# EAGLE design Control (EAGLE 7.6.0)
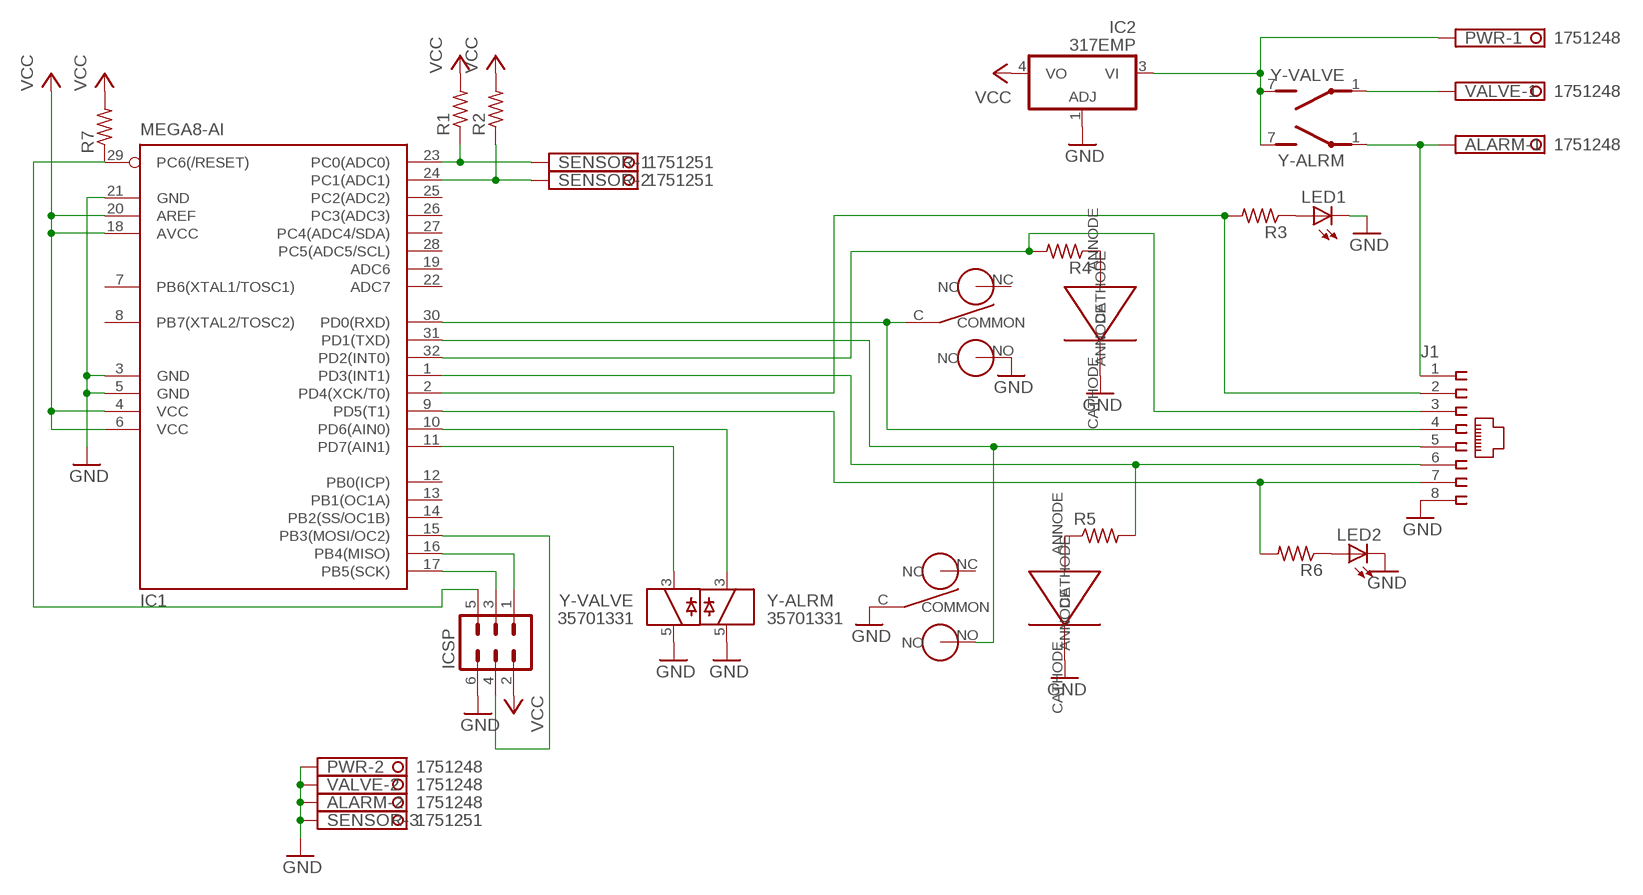
[diagram p0: schematic, sheet 1]

## Parts
ALARM  1751248  [1751248]
BUTTON1  LED-BUTTON-16MM  [16MM]
BUTTON2  LED-BUTTON-16MM  [16MM]
IC1  MEGA8-AI  [TQFP32-08]
IC2  317EMP  [SOT223]
ICSP  MA03-2  [MA03-2]
J1  215877-7  [215877-7]
LED1  LED5MM  [LED5MM]
LED2  LED5MM  [LED5MM]
PWR  1751248  [1751248]
R1  R-US_M0805  [M0805]
R2  R-US_M0805  [M0805]
R3  R-US_M0805  [M0805]
R4  R-US_M0805  [M0805]
R5  R-US_M0805  [M0805]
R6  R-US_M0805  [M0805]
R7  R-US_M0805  [M0805]
SENSOR  1751251  [1751251]
VALVE  1751248  [1751248]
Y-ALRM  35701331  [REED]
Y-VALVE  35701331  [REED]

## Nets
GND: ALARM.2 BUTTON1.CATHODE BUTTON1.NO BUTTON2.C(COMMON) BUTTON2.CATHODE IC1.3(GND) IC1.5(GND) IC1.21(GND) IC2.1(ADJ) ICSP.6 J1.8 LED1.K(C) LED2.K(C) PWR.2 SENSOR.3 VALVE.2 Y-ALRM.5 Y-VALVE.5
N$1: ALARM.1 J1.1 Y-ALRM.1(2:P)
N$2: VALVE.1 Y-VALVE.1(2:P)
N$3: IC1.23(PC0(ADC0)) R1.1 SENSOR.1
N$4: IC1.24(PC1(ADC1)) R2.1 SENSOR.2
N$5: IC1.32(PD2(INT0)) J1.3 R4.2
N$6: IC1.1(PD3(INT1)) J1.6 R5.2
N$7: LED1.A R3.1
N$8: BUTTON2.ANNODE R5.1
N$9: LED2.A R6.1
N$10: BUTTON1.ANNODE R4.1
N$11: BUTTON1.C(COMMON) IC1.30(PD0(RXD)) J1.4
N$12: BUTTON2.NO IC1.31(PD1(TXD)) J1.5
N$13: IC1.2(PD4(XCK/T0)) J1.2 R3.2
N$14: IC1.9(PD5(T1)) J1.7 R6.2
N$15: IC1.11(PD7(AIN1)) Y-VALVE.3
N$16: IC1.10(PD6(AIN0)) Y-ALRM.3
N$18: IC1.29(PC6(/RESET)) ICSP.5 R7.1
N$19: IC1.16(PB4(MISO)) ICSP.1
N$20: IC1.17(PB5(SCK)) ICSP.3
N$21: IC1.15(PB3(MOSI/OC2)) ICSP.4
VCC: IC1.4(VCC) IC1.6(VCC) IC1.18(AVCC) IC1.20(AREF) IC2.4(VO) ICSP.2 R1.2 R2.2 R7.2
VIN: IC2.3(VI) PWR.1 Y-ALRM.7(2:S) Y-VALVE.7(2:S)
Unconnected: BUTTON1.NC BUTTON2.NC IC1.7(PB6(XTAL1/TOSC1)) IC1.8(PB7(XTAL2/TOSC2)) IC1.12(PB0(ICP)) IC1.13(PB1(OC1A)) IC1.14(PB2(SS/OC1B)) IC1.19(ADC6) IC1.22(ADC7) IC1.25(PC2(ADC2)) IC1.26(PC3(ADC3)) IC1.27(PC4(ADC4/SDA)) IC1.28(PC5(ADC5/SCL))

## Library data of the parts
ALARM PWR VALVE = con-phoenix-350:1751248: MKDS 1/ 2-3,5 Printklemme Nennstrom: 10 A Bemessungsspannung: 160 V Raster: 3,5 mm Polzahl: 2 Montageart: Löten Anschlussart: Schraubanschluss Anschlussrichtung vom Leiter zur Platine: 0° Source: http://eshop.phoenixcontact.com .. 1751248.pdf; OC_FARNELL: unknown; OC_NEWARK: unknown
BUTTON1 BUTTON2 = AliExpress:LED-BUTTON-16MM
IC1 = atmel:MEGA8: MICROCONTROLLER 8 Kbytes FLASH, 1 kbytes SRAM, 512 bytes EEPROM, USART, 6-channel 10 bit ADC, 2-channel 8 bit ADC Pin compatible with Atmega48, ATMega88, ATMega168 Source: avr.lbr; MPN: ATMEGA8-16AU; OC_FARNELL: 9171371; OC_NEWARK: 73M8863
IC2 = linear:*317: Positive VOLTAGE REGULATOR
ICSP = con-lstb:MA03-2: PIN HEADER; OC_FARNELL: unknown; OC_NEWARK: unknown
J1 = con-amp:215877-7: AMP connector
LED1 LED2 = led:LED: LED OSRAM: - CHIPLED LG R971, LG N971, LY N971, LG Q971, LY Q971, LO R971, LY R971 LH N974, LH R974 LS Q976, LO Q976, LY Q976 LO Q996 - Hyper CHIPLED LW Q18S LB Q993, LB Q99A, LB R99A - SideLED LS A670, LO A670, LY A670, LG A670, LP A670 LB A673, LV A673, LT A673, LW A673 LH A674 LY A675 LS A676, LA A676, LO A676, LY A676, LW A676 LS A679, LY A679, LG A679 - Hyper Micro SIDELED® LS Y876, LA Y876, LO Y876, LY Y876 LT Y87S - SmartLED LW L88C, LW L88S LB L89C, LB L89S, LG L890 LS L89K, LO L89K, LY L89K LS L896, LA L896, LO L896, LY L896 - TOPLED LS T670, LO T670, LY T670, LG T670, LP T670 LSG T670, LSP T670, LSY T670, LOP T670, LYG T670 LG T671, LOG T671, LSG T671 LB T673, LV T673, LT T673, LW T673 LH T674 LS T676, LA T676, LO T676, LY T676, LB T676, LH T676, LSB T676, LW T676 LB T67C, LV T67C, LT T67C, LS T67K, LO T67K, LY T67K, LW E67C LS E67B, LA E67B, LO E67B, LY E67B, LB E67C, LV E67C, LT E67C LW T67C LS T679, LY T679, LG T679 LS T770, LO T770, LY T770, LG T770, LP T770 LB T773, LV T773, LT T773, LW T773 LH T774 LS E675, LA E675, LY E675, LS T675 LS T776, LA T776, LO T776, LY T776, LB T776 LHGB T686 LT T68C, LB T68C - Hyper Mini TOPLED® LB M676 - Mini TOPLED Santana® LG M470 LS M47K, LO M47K, LY M47K Source: http://www.osram.convergy.de LUXEON: - LUMILED® LXK2-PW12-R00, LXK2-PW12-S00, LXK2-PW14-U00, LXK2-PW14-V00 LXK2-PM12-R00, LXK2-PM12-S00, LXK2-PM14-U00 LXK2-PE12-Q00, LXK2-PE12-R00, LXK2-PE12-S00, LXK2-PE14-T00, LXK2-PE14-U00 LXK2-PB12-K00, LXK2-PB12-L00, LXK2-PB12-M00, LXK2-PB14-N00, LXK2-PB14-P00, LXK2-PB14-Q00 LXK2-PR12-L00, LXK2-PR12-M00, LXK2-PR14-Q00, LXK2-PR14-R00 LXK2-PD12-Q00, LXK2-PD12-R00, LXK2-PD12-S00 LXK2-PH12-R00, LXK2-PH12-S00 LXK2-PL12-P00, LXK2-PL12-Q00, LXK2-PL12-R00 Source: www.luxeon.com KINGBRIGHT: KA-3528ASYC Source: www.kingbright.com
R1-R7 = resistor:R-US_: RESISTOR, American symbol
SENSOR = con-phoenix-350:1751251: MKDS 1/ 3-3,5 Printklemme Nennstrom: 10 A Bemessungsspannung: 160 V Raster: 3,5 mm Polzahl: 3 Montageart: Löten Anschlussart: Schraubanschluss Anschlussrichtung vom Leiter zur Platine: 0° Source: http://eshop.phoenixcontact.com .. 1751251.pdf; OC_FARNELL: unknown; OC_NEWARK: unknown
Y-ALRM Y-VALVE = relay:35701331: RELAY reed, 1 x norm. open with polarity; OC_FARNELL: unknown; OC_NEWARK: unknown

## Board
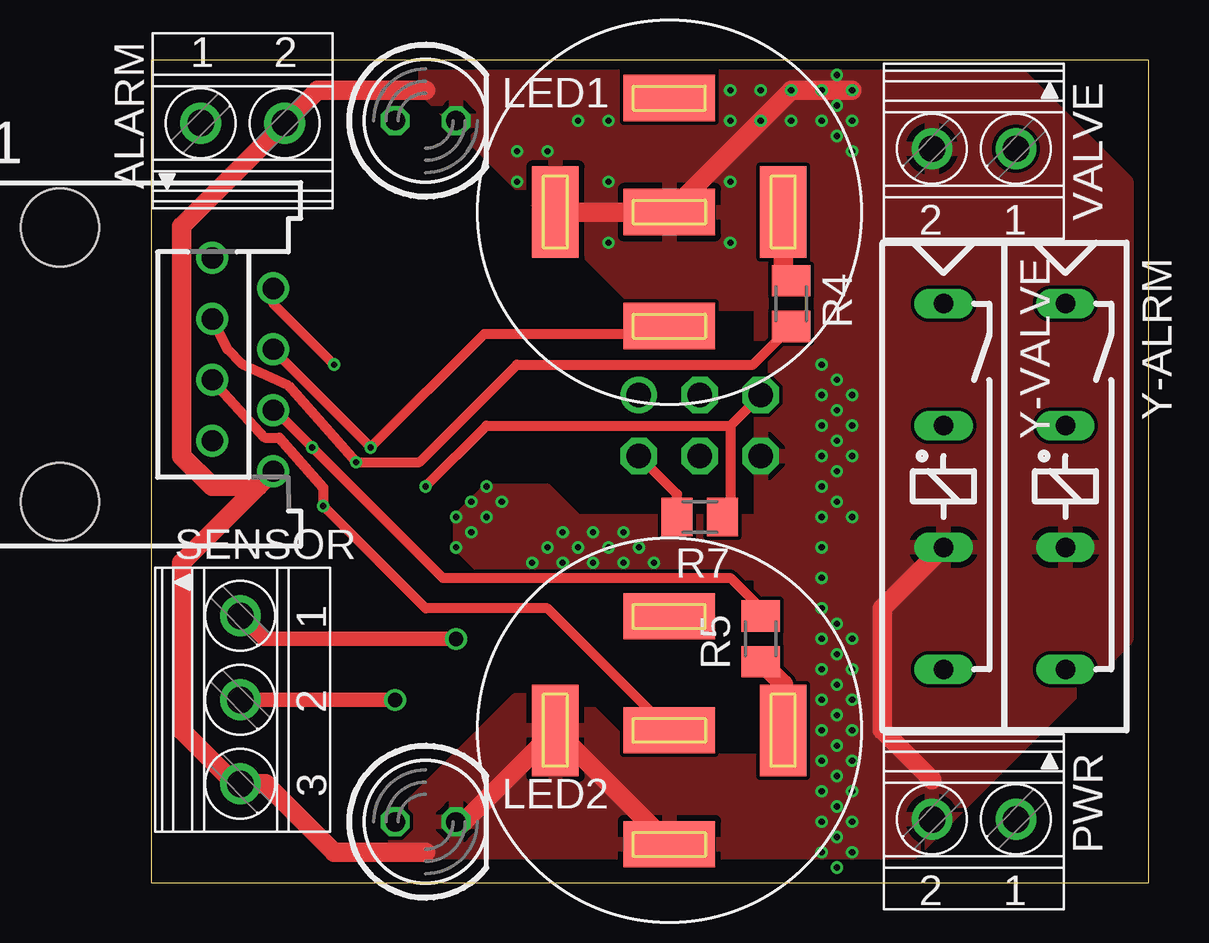
[diagram p1: board, top side]
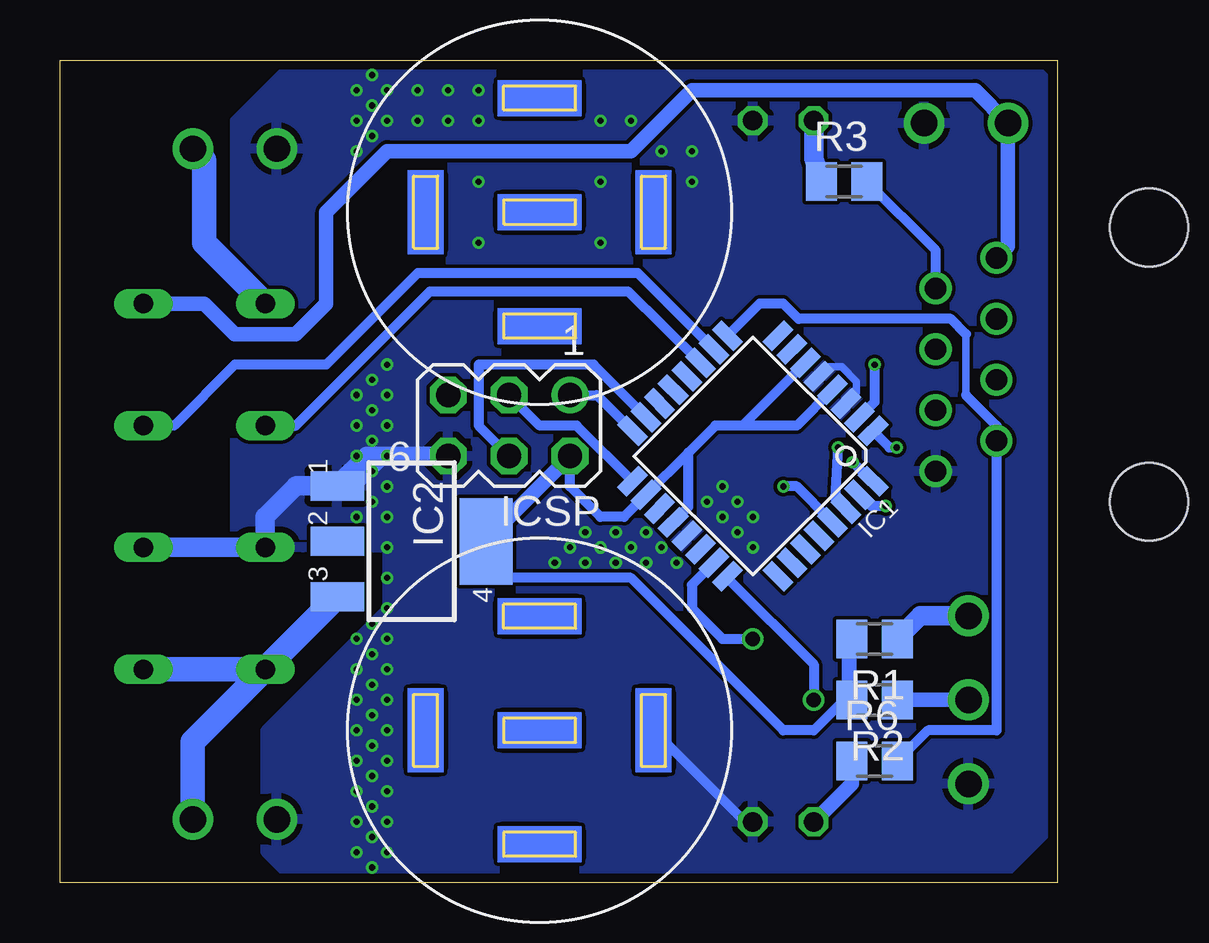
[diagram p2: board, bottom side, seen from below]

Size 41.58 x 34.28 mm. Coordinates in mm from the lower left corner, seen from the top.
Outline: 0,0 41.58,0 41.58,34.28 0,34.28 0,0
Copper layers (1*16): Top 0.035559375mm / dielectric 1.6mm / Bottom 0.035559375mm
Design rules "oshpark-2layer": minimum track width 6mil, minimum drill 10mil, track to track 6mil, track to pad 6mil, pad to pad 6mil, via to via 6mil, smd to smd 6mil, copper to edge 15mil, drill to drill 6mil, minimum pad ring 5mil, minimum via ring 5mil, stop-mask expansion 2.5mil, vias tented up to drill 0mil, thermal gap 10mil

### Footprints (pad centres in the part's own frame; a part is rotated, then mirrored left to right if it is on the bottom)
1751248 = drill 1.1 pad 1.7: 1 -1.75,-0.1; 2 1.75,-0.1
16MM = smd 1.93 x 3.81: ANNODE 4.75,0; CATHODE -4.75,0 | smd 3.81 x 1.93: C 0,-4.75; NC 0,4.75; NO 0,0
TQFP32-08 = smd 1.27 x 0.559: 1 -4.293,2.8; 2 -4.293,2; 3 -4.293,1.2; 4 -4.293,0.4; 5 -4.293,-0.4; 6 -4.293,-1.2; 7 -4.293,-2; 8 -4.293,-2.8; 17 4.293,-2.8; 18 4.293,-2; 19 4.293,-1.2; 20 4.293,-0.4; 21 4.293,0.4; 22 4.293,1.2; 23 4.293,2; 24 4.293,2.8 | smd 0.559 x 1.27: 9 -2.8,-4.293; 10 -2,-4.293; 11 -1.2,-4.293; 12 -0.4,-4.293; 13 0.4,-4.293; 14 1.2,-4.293; 15 2,-4.293; 16 2.8,-4.293; 25 2.8,4.293; 26 2,4.293; 27 1.2,4.293; 28 0.4,4.293; 29 -0.4,4.293; 30 -1.2,4.293; 31 -2,4.293; 32 -2.8,4.293
SOT223 = smd 1.219 x 2.235: 1 -2.311,-3.099; 2 0,-3.099; 3 2.311,-3.099 | smd 3.6 x 2.2: 4 0,3.099
MA03-2 = drill 1.016: 1 -2.54,-1.27 | drill 1.016 octagon: 2 -2.54,1.27; 3 0,-1.27; 4 0,1.27; 5 2.54,-1.27; 6 2.54,1.27
215877-7 = drill 0.889: 1 -4.445,6.35; 2 -3.175,8.89; 3 -1.905,6.35; 4 -0.635,8.89; 5 0.635,6.35; 6 1.905,8.89; 7 3.175,6.35; 8 4.445,8.89 | hole 3.251: -5.715,0; 5.715,0
LED5MM = drill 0.813 octagon: A -1.27,0; K 1.27,0
M0805 = smd 1.3 x 1.6: 1 -0.95,0; 2 0.95,0
1751251 = drill 1.1 pad 1.7: 1 -3.5,-0.1; 2 0,-0.1; 3 3.5,-0.1
REED = drill 0.813 long: 1 -17.78,2.54; 3 -12.7,2.54; 5 -7.62,2.54; 7 -2.54,2.54

### Placement (x,y rotation side)
ALARM  3.81,31.75 0 top
BUTTON1  21.59,27.94 0 top
BUTTON2  21.59,6.35 0 top
IC1  12.7,17.78 225 bottom
IC2  26.92,14.22 270 bottom
ICSP  22.86,19.05 180 bottom
J1  -3.81,21.59 270 top
LED1  11.43,31.75 0 top
LED2  11.43,2.54 0 top
PWR  34.29,2.54 180 top
R1  7.62,10.16 180 bottom
R2  7.62,7.62 180 bottom
R3  8.89,29.21 0 bottom
R4  26.67,24.13 270 top
R5  25.4,10.16 90 top
R6  7.62,5.08 0 bottom
R7  22.86,15.24 180 top
SENSOR  3.81,7.62 270 top
VALVE  34.29,30.48 180 top
Y-ALRM  35.56,6.35 270 top
Y-VALVE  30.48,6.35 270 top

### Tracks (layer width: path | path; a pad name or v marks a point on that pad's centre or on a via)
GND  (via drill 0.25)
  Top 0.813: BUTTON2.C BUTTON2.CATHODE 13.03,2.54 | 11.43,1.27 7.62,1.27 4.77,4.12 SENSOR.3 3.5,4.12 1.27,6.35 1.27,13.34 J1.8 4.45,16.51 2.54,16.51 1.27,17.78 1.27,27.36 ALARM.2 6.93,33.02 11.43,33.02 | v29.21,33.02 v26.67,33.02 BUTTON1.NO BUTTON1.CATHODE 16.51,27.94 | Y-VALVE.5 30.48,11.43 30.48,6.35 32.54,4.29
  Bottom 0.152: 9.6,21.49 9.91,21.18 IC1.5 | 8.69,20.12 IC1.3
  Bottom 0.305: 9.6,21.49 8.99,21.49 8.38,20.88 8.38,20.42 8.69,20.12
  Bottom 0.406: BUTTON2.CATHODE 13.03,2.54 | v27.94,17.78 29.21,16.51 31.75,16.51
  Bottom 0.813: Y-ALRM.5 Y-VALVE.5 33.02,15.24 31.75,16.51 31.73,16.54 IC2.1 28.78,17.78 v27.94,17.78 ICSP.6
  other vias: 13.97,15.24 12.7,13.97 12.7,15.24 13.97,16.51 16.51,13.97 17.14,14.61 17.78,13.97 19.05,29.21 19.05,26.67 24.13,26.67 24.13,29.21 24.13,31.75 25.4,31.75 25.4,33.02 24.13,33.02 19.05,31.75 17.78,31.75 25.4,33.02 26.67,31.75 27.94,31.75 27.94,33.02 29.21,31.75 29.21,30.48 29.21,20.32 27.94,21.59 27.94,20.32 27.94,19.05 29.21,19.05 29.21,17.78 27.94,19.05 17.78,13.97 19.05,13.97 20.32,13.97 18.41,14.61 19.68,14.61 14.61,15.88 13.34,15.88 13.34,14.61 17.14,13.34 18.41,13.34 19.68,13.34 20.95,13.34 29.21,10.16 29.21,8.89 29.21,7.62 29.21,6.35 29.21,5.08 29.21,3.81 29.21,2.54 29.21,1.27 27.94,1.27 27.94,2.54 27.94,3.81 27.94,5.08 27.94,6.35 27.94,7.62 27.94,8.89 27.94,10.16 28.57,18.41 28.57,19.68 28.57,20.95 28.57,9.53 28.57,9.53 28.57,10.79 28.57,31.11 28.57,32.38 28.57,33.66 28.57,8.26 28.57,6.99 28.57,5.71 28.57,4.45 28.57,3.17 28.57,1.91 28.57,0.64 15.88,13.34 27.94,16.51 27.94,15.24 27.94,13.97 27.94,12.7 27.94,11.43 28.57,17.14 28.57,15.88 29.21,15.24 16.51,30.48 15.24,30.48 15.24,29.21
  pour Bottom: 0,2.54 0,33.02 1.27,34.29 31.75,34.29 34.29,31.75 34.29,13.97 27.94,13.97 27.94,11.43 33.02,6.35 33.02,1.27 31.75,0 2.54,0
  pour Top: 11.43,34.29 35.56,34.29 40.64,29.21 40.64,10.16 31.75,1.27 10.16,1.27 10.16,2.54 15.24,7.62 17.78,7.62 20.32,5.08 26.67,5.08 25.4,7.62 25.4,24.13 20.32,24.13 11.43,33.02
  pour Top: 13.97,12.7 12.7,13.97 12.7,15.24 13.97,16.51 16.51,16.51 17.78,15.24 25.4,15.24 25.4,12.7
N$1
  Bottom 0.61: Y-ALRM.1 35.56,24.13 34.29,22.86 31.75,22.86 30.48,24.13 30.48,27.94 27.94,30.48 17.78,30.48 15.24,33.02 3.43,33.02 ALARM.1 2.06,26.52 J1.1
N$2
  Bottom 1.016: Y-VALVE.1 35.56,26.67 35.56,30.1 VALVE.1
N$3  (via drill 0.6)
  Top 0.61: v12.7,10.16 4.67,10.16 SENSOR.1
  Bottom 0.406: IC1.23 15.24,12.41 15.24,11.43 13.97,10.16 v12.7,10.16
  Bottom 0.813: R1.1 5.71,11.12 SENSOR.1
N$4  (via drill 0.6)
  Top 0.61: SENSOR.2 v10.16,7.62
  Bottom 0.152: 13.72,12.65 IC1.24 | 6.86,7.47 R2.1
  Bottom 0.406: 13.72,12.65 10.16,9.09 v10.16,7.62
  Bottom 0.61: R2.1 SENSOR.2
N$5  (via drill 0.25)
  Top 0.254: 25.08,21.59 R4.2
  Top 0.406: J1.3 3.17,22.23 3.81,21.59 5.71,20.7 v8.53,17.53 11.18,17.53 15.24,21.59 25.08,21.59 R4.2
  Bottom 0.152: 7.77,16.76 IC1.32
  Bottom 0.406: 7.77,16.76 v8.53,17.53
N$6  (via drill 0.25)
  Top 0.152: 5.18,19.66 J1.6
  Top 0.254: 25.4,11.43 R5.2
  Top 0.305: 5.16,19.68 J1.6
  Top 0.406: 25.4,11.43 24.13,12.7 12.14,12.7 v6.71,18.14 5.16,19.68
  Bottom 0.152: 7.62,18.75 IC1.1 | 5.03,19.66 J1.6
  Bottom 0.406: 7.62,18.75 7.01,18.14 v6.71,18.14
N$7
  Bottom 0.813: R3.1 10.16,30.16 LED1.A
N$8
  Top 0.813: BUTTON2.ANNODE 26.34,8.27 R5.1
N$9
  Bottom 0.61: R6.1 8.57,4.13 LED2.A
N$10
  Top 0.813: R4.1 26.34,25.41 BUTTON1.ANNODE
N$11  (via drill 0.25)
  Top 0.254: BUTTON1.C 21.26,22.86 | 13.34,22.23 13.97,22.86 13.87,22.86
  Top 0.305: 5.08,22.2 J1.4
  Top 0.406: 21.26,22.86 13.97,22.86 | 13.87,22.86 v9.14,18.14 5.08,22.2
  Bottom 0.152: 8.84,15.7 IC1.30
  Bottom 0.305: 8.84,15.7 9.27,16
  Bottom 0.406: v9.14,18.14 9.27,16
N$12  (via drill 0.25)
  Top 0.152: 2.59,20.88 J1.5
  Top 0.406: 2.59,20.88 4.72,18.54 5.33,18.54 7.16,16.46 v7.16,15.7 11.43,11.43 16.51,11.43 BUTTON2.NO
  Bottom 0.152: 8.23,16.15 IC1.31
  Bottom 0.305: 8.23,16.15 7.77,15.7
  Bottom 0.406: 7.77,15.7 v7.16,15.7
N$13  (via drill 0.25)
  Top 0.406: v7.62,21.59 5.08,24.13 J1.2
  Bottom 0.152: 8.38,19.36 IC1.2 | 5.03,24.69 J1.2
  Bottom 0.406: IC1.2 7.62,20.03 v7.62,21.59 | J1.2 5.08,26.35 R3.2
N$14
  Bottom 0.305: 3.81,20.32 3.81,22.86
  Bottom 0.406: 3.81,20.32 2.54,19.05 J1.7 2.54,6.35 5.4,6.35 R6.2 | 3.81,22.86 4.45,23.5 10.79,23.5 11.43,24.13 12.42,24.13 IC1.9
N$15
  Bottom 0.406: Y-VALVE.3 31.75,19.05 26.16,24.64 17.91,24.64 IC1.11
N$16
  Bottom 0.406: IC1.10 17.49,25.4 26.67,25.4 30.48,21.59 34.29,21.59 36.83,19.05 Y-ALRM.3
N$18  (via drill 0.25)
  Top 0.152: 23.77,15.09 R7.1
  Top 0.406: ICSP.5 24.13,19.05 | 24.13,19.05 24.13,15.56 R7.1 | v11.43,16.51 13.97,19.05 24.13,19.05
  Bottom 0.152: 9.45,15.09 IC1.29
  Bottom 0.406: 9.45,15.09 10.87,16.51 v11.43,16.51
N$19
  Bottom 0.406: ICSP.1 19.2,20.32 IC1.16
N$20
  Bottom 0.406: ICSP.3 21.59,19.05 20.04,19.05 IC1.17
N$21
  Bottom 0.406: IC1.15 19.34,21.59 24.13,21.59 24.13,19.05 ICSP.4
VCC
  Top 0.406: R7.2 21.91,16.19 ICSP.2
  Bottom 0.152: 8.69,10.21 R1.2
  Bottom 0.254: 8.69,10.21 8.89,10.01 8.89,7.62
  Bottom 0.406: R2.2 R1.2 | ICSP.2 20.32,16.51 19.05,15.24 18.07,15.24 IC1.18 15.38,17.92 | 8.89,7.62 10.16,6.35 11.43,6.35 17.78,12.7 22.86,12.7 23.82,13.66 IC2.4 | 15.38,17.92 14.26,19.05 13.97,19.05 13.13,19.05 | IC1.20 15.38,15.66 15.38,17.92 | IC1.4 10.86,19.05 13.13,19.05 | IC1.6 13.13,19.05
  Bottom 0.61: IC2.4 23.82,14.28 ICSP.2
VIN
  Bottom 0.813: IC2.3 30.02,11.89
  Bottom 1.016: PWR.1 36.04,5.87 Y-VALVE.7 | Y-VALVE.7 33.02,8.91 IC2.3 | Y-ALRM.7 Y-VALVE.7